# Altium project roneMotorBoard-v8.PrjPcb
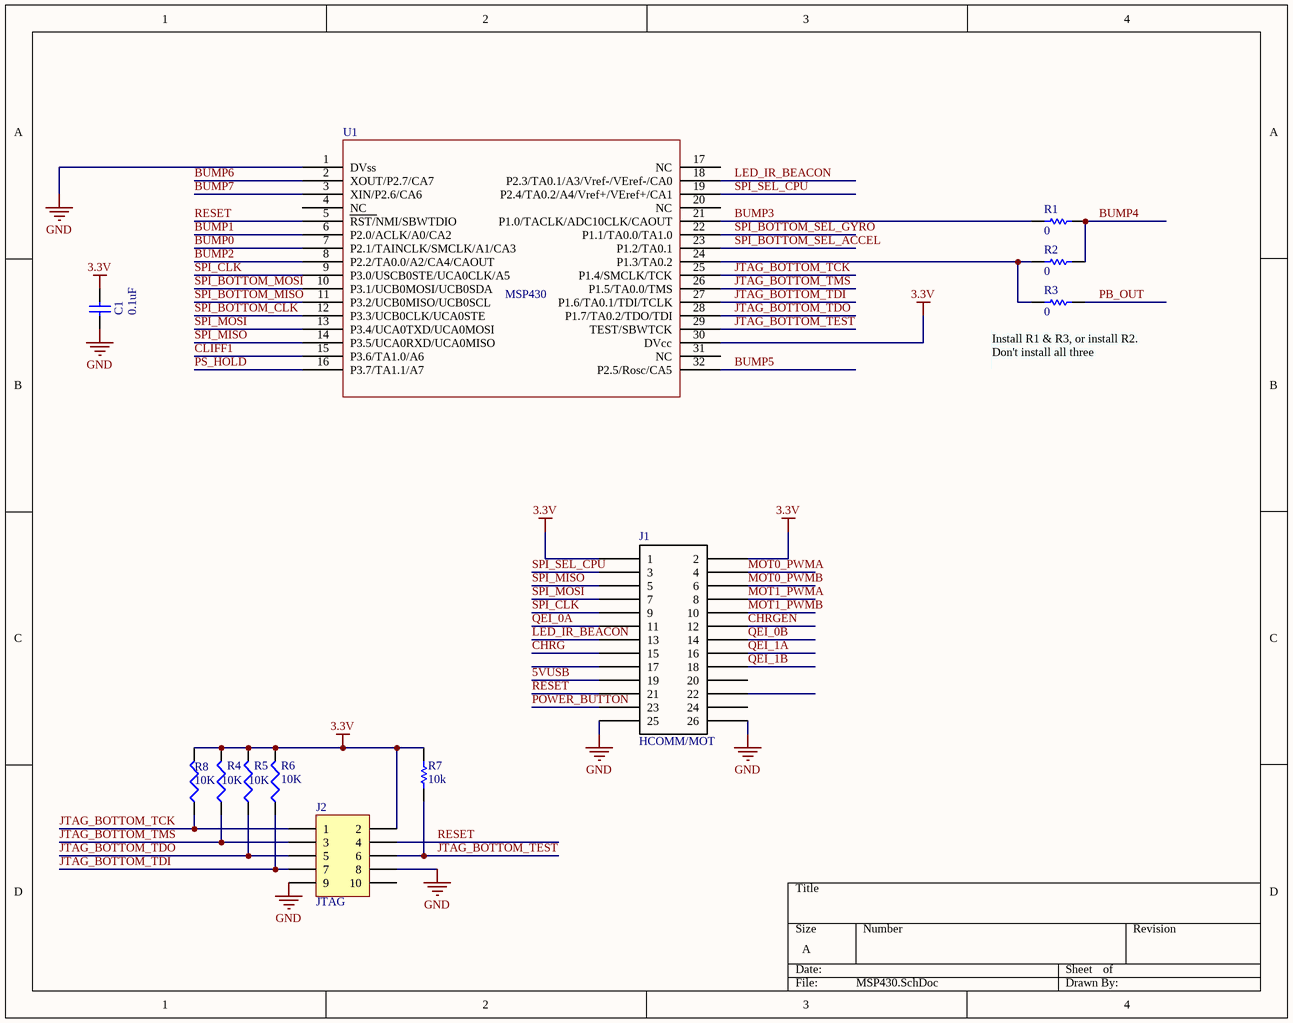
[diagram p0: MSP430.SchDoc]
5 sheets, 94 parts. Net scope: global (net labels, ports and power ports of the same name join across sheets).
Board file: roneMotorBoard-v8.PcbDoc
Sheets:
  MSP430.SchDoc
  power.SchDoc
  motorEncoder.SchDoc
  GyroAccelHeaders.SchDoc
  BumpSensors.SchDoc

## Sheet MSP430.SchDoc
size A

### Parts
C1  value 0.1uF  [CAPC1005L]  (hidden comment: Cap Semi)
J1  HCOMM/MOT  [HeaderSM 13x2]
J2  JTAG  [HDR2X5]
R1  value 0  [RESC1608L]  (hidden comment: Res Semi)
R2  value 0  [RESC1608L]  (hidden comment: Res Semi)
R3  value 0  [RESC1608L]  (hidden comment: Res Semi)
R4  value 10K  [RESC1608L]  (hidden comment: Res3)
R5  value 10K  [RESC1608L]  (hidden comment: Res3)
R6  value 10K  [RESC1608L]  (hidden comment: Res3)
R7  value 10k  [RESC1608L]  (hidden comment: Res Semi)
R8  value 10K  [RESC1608L]  (hidden comment: Res3)
U1  MSP430  [MSP430_32PIN]

### Nets
3.3V: C1.2 J1.1 J1.2 J2.2 R4.2 R5.2 R6.2 R7.2 R8.2 U1.30(DVcc)
GND: C1.1 J1.25 J1.26 J2.8 J2.9 U1.1(DVss)
5VUSB: J1.19
BUMP0: U1.7(P2.1/TAINCLK/SMCLK/A1/CA3)
BUMP1: U1.6(P2.0/ACLK/A0/CA2)
BUMP2: U1.8(P2.2/TA0.0/A2/CA4/CAOUT)
BUMP3: R1.2 U1.21(P1.0/TACLK/ADC10CLK/CAOUT)
BUMP4: R1.1 R2.1
BUMP5: U1.32(P2.5/Rosc/CA5)
BUMP6: U1.2(XOUT/P2.7/CA7)
BUMP7: U1.3(XIN/P2.6/CA6)
CHRG: J1.15
CHRGEN: J1.12
CLIFF1: U1.15(P3.6/TA1.0/A6)
JTAG_BOTTOM_TCK: J2.1 R8.1 U1.25(P1.4/SMCLK/TCK)
JTAG_BOTTOM_TDI: J2.7 R6.1 U1.27(P1.6/TA0.1/TDI/TCLK)
JTAG_BOTTOM_TDO: J2.5 R5.1 U1.28(P1.7/TA0.2/TDO/TDI)
JTAG_BOTTOM_TEST: J2.6 R7.1 U1.29(TEST/SBWTCK)
JTAG_BOTTOM_TMS: J2.3 R4.1 U1.26(P1.5/TA0.0/TMS)
LED_IR_BEACON: J1.13 U1.18(P2.3/TA0.1/A3/Vref-/VEref-/CA0)
MOT0_PWMA: J1.4
MOT0_PWMB: J1.6
MOT1_PWMA: J1.8
MOT1_PWMB: J1.10
PB_OUT: R3.1
POWER_BUTTON: J1.23
PS_HOLD: U1.16(P3.7/TA1.1/A7)
QEI_0A: J1.11
QEI_0B: J1.14
QEI_1A: J1.16
QEI_1B: J1.18
RESET: J1.21 J2.4 U1.5(RST/NMI/SBWTDIO)
SPI_BOTTOM_CLK: U1.12(P3.3/UCB0CLK/UCA0STE)
SPI_BOTTOM_MISO: U1.11(P3.2/UCB0MISO/UCB0SCL)
SPI_BOTTOM_MOSI: U1.10(P3.1/UCB0MOSI/UCB0SDA)
SPI_BOTTOM_SEL_ACCEL: U1.23(P1.2/TA0.1)
SPI_BOTTOM_SEL_GYRO: U1.22(P1.1/TA0.0/TA1.0)
SPI_CLK: J1.9 U1.9(P3.0/USCB0STE/UCA0CLK/A5)
SPI_MISO: J1.5 U1.14(P3.5/UCA0RXD/UCA0MISO)
SPI_MOSI: J1.7 U1.13(P3.4/UCA0TXD/UCA0MOSI)
SPI_SEL_CPU: J1.3 U1.19(P2.4/TA0.2/A4/Vref+/VEref+/CA1)
NetR2_2: R2.2 R3.2 U1.24(P1.3/TA0.2)

Not connected (* = marked no-connect by the designer): J1 17 20 22 24; J2 10; U1 4(NC) 17(NC) 20(NC) 31(NC)

### Notes on the sheet
- (near R3) Install R1 & R3, or install R2.  Don't install all three

### Library data of the parts
C1 = Cap Semi: Capacitor (Semiconductor SIM Model); Published: 8-Jun-2000; LatestRevisionDate: 29-May-2009; LatestRevisionNote: IPC-7351 Footprint Added.; PackageReference: C1206; Publisher: Altium Limited; PackageDescription: Chip Capacitor
J1 = HCOMM/HMOT: Header, 2X20, 50mil, IDC
J2 = Header 5X2: Header, 5-Pin, Dual row; LatestRevisionDate: 17-Jul-2002; LatestRevisionNote: Re-released for DXP Platform.; Publisher: Altium Limited
R1-R3 R7 = Res Semi: Semiconductor Resistor; Published: 8-Jun-2000; LatestRevisionDate: 17-Jul-2002; LatestRevisionNote: Re-released for DXP Platform.; PackageReference: AXIAL-0.5; Publisher: Altium Limited
R4-R6 R8 = Res3: Resistor; Published: 8-Jun-2000; LatestRevisionDate: 29-May-2009; LatestRevisionNote: IPC-7351 Footprint Added.; PackageReference: J1-0603; Publisher: Altium Limited; PackageDescription: Chip Resistor
U1 = MSP430_32pin

## Sheet power.SchDoc
size A
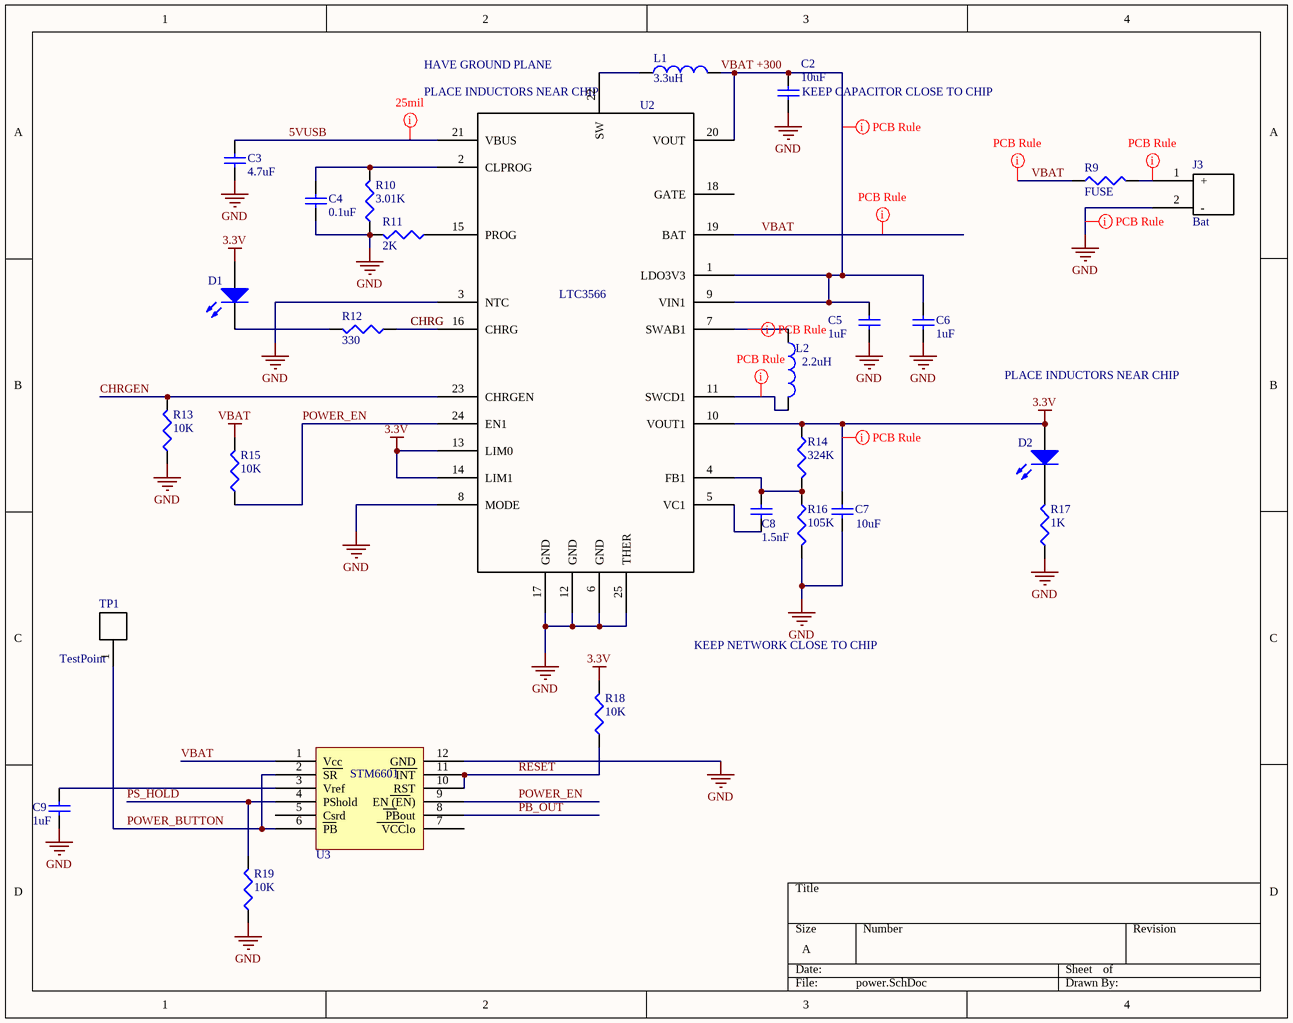
[diagram p1: power.SchDoc]

### Parts
C2  value 10uF  [CAPC1608L]  (hidden comment: Cap)
C3  value 4.7uF  [CAPC1608L]  (hidden comment: Cap)
C4  value 0.1uF  [CAPC1005L]  (hidden comment: Cap)
C5  value 1uF  [CAPC1608L]  (hidden comment: Cap)
C6  value 1uF  [CAPC1608L]  (hidden comment: Cap)
C7  value 10uF  [CAPC1608L]  (hidden comment: Cap)
C8  value 1.5nF  [CAPC1005L]  (hidden comment: Cap)
C9  value 1uF  [CAPC1608L]  (hidden comment: Cap)
D1  Charge  [INDC2012L]  (value not drawn)
D2  Power  [INDC2012L]  (value not drawn)
J3  Bat  [BatteryConnJST]
L1  3.3uH  [IndPow]
L2  2.2uH  [IndPow]
R9  value FUSE  [RESC3225L]  (hidden comment: Res3)
R10  value 3.01K  [RESC1608L]  (hidden comment: Res3)
R11  value 2K  [RESC1608L]  (hidden comment: Res3)
R12  value 330  [RESC1608L]  (hidden comment: Res3)
R13  value 10K  [RESC1608L]  (hidden comment: Res3)
R14  value 324K  [RESC1608L]  (hidden comment: Res3)
R15  value 10K  [RESC1608L]  (hidden comment: Res3)
R16  value 105K  [RESC1608L]  (hidden comment: Res3)
R17  value 1K  [RESC1608L]  (hidden comment: Res3)
R18  value 10K  [RESC1608L]  (hidden comment: Res3)
R19  value 10K  [RESC1608L]  (hidden comment: Res3)
TP1  TestPoint  [TestPoint]
U2  LTC3566  [QFN-24]
U3  STM6601  [TDFN12]

### Nets
3.3V: C7.2 D1.1(A) D2.1(A) R14.1 R18.2 U2.10(VOUT1) U2.13(LIM0) U2.14(LIM1)
GND: C2.1 C3.1 C4.1 C5.2 C6.2 C7.1 C9.2 J3.2(-) R10.1 R11.2 R13.1 R16.2 R17.1 R19.1 U2.3(NTC) U2.6(GND) U2.8(MODE) U2.12(GND) U2.17(GND) U2.25(THER) U3.12(GND)
VBAT: R9.1 R15.2 U2.19(BAT) U3.1(Vcc)
5VUSB: C3.2 U2.21(VBUS)
CHRG: R12.1 U2.16(CHRG)
CHRGEN: R13.2 U2.23(CHRGEN)
PB_OUT: U3.8(PBout)
POWER_BUTTON: TP1.1 U3.2(SR) U3.6(PB)
POWER_EN: R15.1 U2.24(EN1) U3.9(EN_(EN))
PS_HOLD: R19.2 U3.4(PShold)
RESET: R18.1 U3.10(RST) U3.11(INT)
VBAT +300: C2.2 C5.1 C6.1 L1.2 U2.1(LDO3V3) U2.9(VIN1) U2.20(VOUT)
NetC4_2: C4.2 R10.2 U2.2(CLPROG)
NetC8_1: C8.1 R14.2 R16.1 U2.4(FB1)
NetC8_2: C8.2 U2.5(VC1)
NetC9_1: C9.1 U3.3(Vref)
NetD1_2: D1.2(K) R12.2
NetD2_2: D2.2(K) R17.2
NetJ3_1: J3.1(+) R9.2
NetL1_1: L1.1 U2.22(SW)
NetL2_1: L2.1 U2.7(SWAB1)
NetL2_2: L2.2 U2.11(SWCD1)
NetR11_1: R11.1 U2.15(PROG)

Not connected (* = marked no-connect by the designer): U2 18(GATE); U3 5(Csrd) 7(VCClo)

### Layout directives
rule Width Constraint [Pref Width = 25mil    Min Width = 10mil    Max Width = 25mil]: 5VUSB, GND, NetJ3_1, NetL2_1, NetL2_2, VBAT, VBAT +300
rule Width Constraint [Pref Width = 25mil    Min Width = 10mil    Max Width = 100mil]: 3.3V
rule Width Constraint [Pref Width = 25mil    Min Width = 10mil    Max Width = 50mil]: VBAT

### Notes on the sheet
- (near U2) HAVE GROUND PLANE
- (near U2) PLACE INDUCTORS NEAR CHIP
- (near C2) KEEP CAPACITOR CLOSE TO CHIP
- CHRG
- PLACE INDUCTORS NEAR CHIP
- KEEP NETWORK CLOSE TO CHIP

### Library data of the parts
C2-C9 = Cap: Capacitor; Published: 8-Jun-2000; LatestRevisionDate: 17-Jul-2002; LatestRevisionNote: Re-released for DXP Platform.; PackageReference: RAD-0.3; Publisher: Altium Limited
D1 D2 = LED2: Typical RED, GREEN, YELLOW, AMBER GaAs LED; Published: 8-Jun-2000; LatestRevisionDate: 17-Jul-2002; LatestRevisionNote: Re-released for DXP Platform.; PackageVersion: Feb-2002; PackageReference: 3.2X1.6X1.1; Publisher: Altium Limited
J3 = BatteryConnJST
L1 L2 = Inductor
  L1: Value: 3.3uH
  L2: Value: 2.2uH
R9-R19 = Res3: Resistor; Published: 8-Jun-2000; LatestRevisionDate: 29-May-2009; LatestRevisionNote: IPC-7351 Footprint Added.; PackageReference: J1-0603; Publisher: Altium Limited; PackageDescription: Chip Resistor

## Sheet motorEncoder.SchDoc
size A
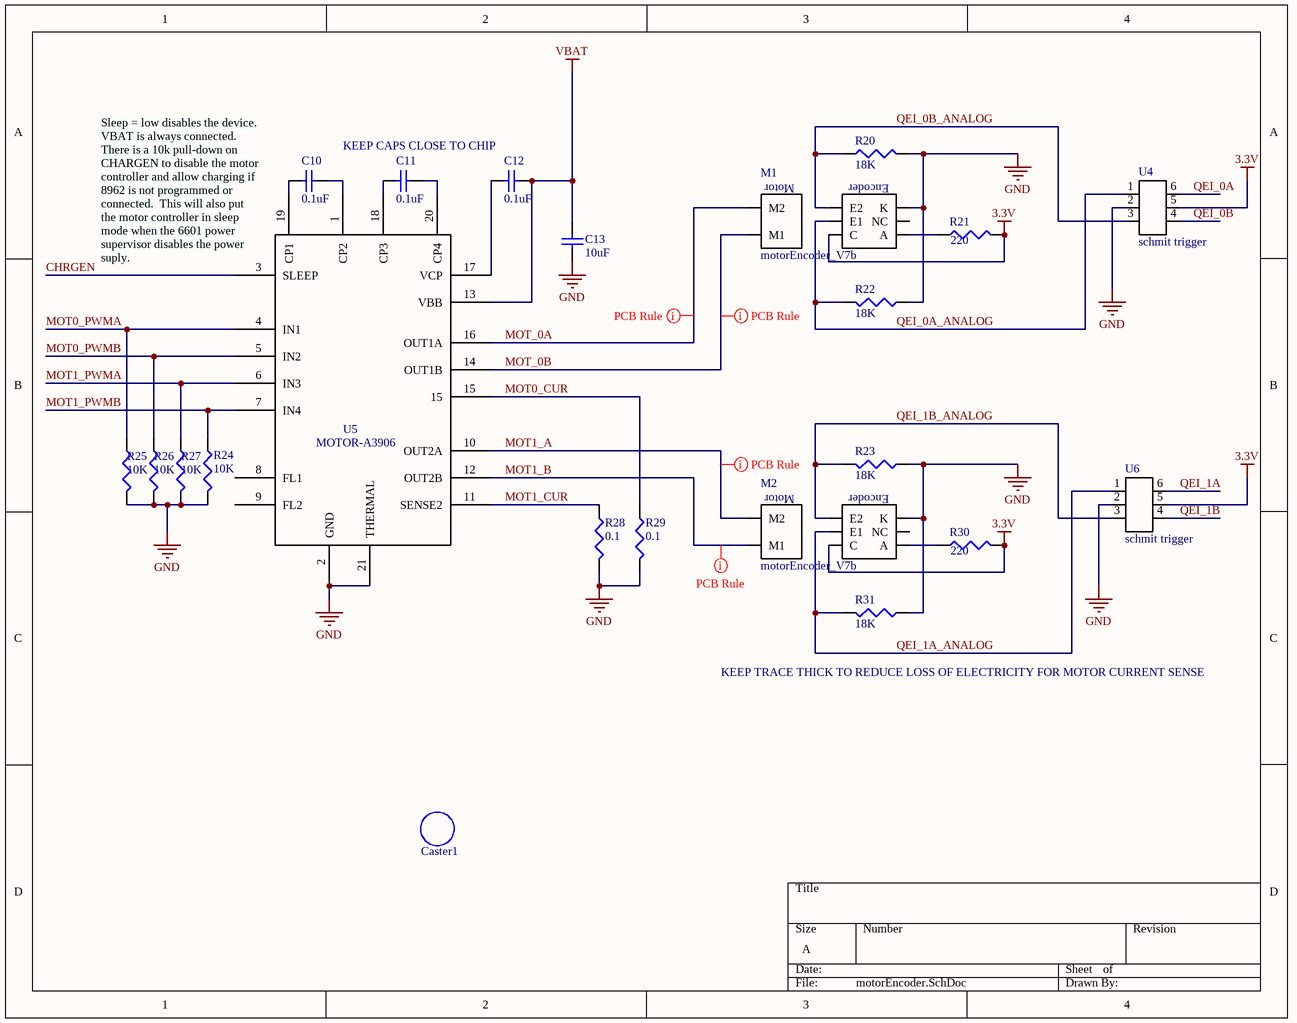
[diagram p2: motorEncoder.SchDoc]

### Parts
C10  value 0.1uF  [CAPC1005L]  (hidden comment: Cap Semi)
C11  value 0.1uF  [CAPC1005L]  (hidden comment: Cap Semi)
C12  value 0.1uF  [CAPC1005L]  (hidden comment: Cap Semi)
C13  value 10uF  [CAPC1608L]  (hidden comment: Cap Semi)
Caster1  non connect  [3/4"CASTER2]  (value not drawn)
M1  motorEncoder_V7b  [motorEncoder_V7b]
M2  motorEncoder_V7b  [motorEncoder_V7b]
R20  value 18K  [RESC1608L]
R21  value 220  [RESC1608L]
R22  value 18K  [RESC1608L]
R23  value 18K  [RESC1608L]
R24  value 10K  [RESC1608L]  (hidden comment: Res3)
R25  value 10K  [RESC1608L]  (hidden comment: Res3)
R26  value 10K  [RESC1608L]  (hidden comment: Res3)
R27  value 10K  [RESC1608L]  (hidden comment: Res3)
R28  value 0.1  [RESC1608L]  (hidden comment: Res3)
R29  value 0.1  [RESC1608L]  (hidden comment: Res3)
R30  value 220  [RESC1608L]
R31  value 18K  [RESC1608L]
U4  schmit trigger  [DCK(R-PDSO-C6)]
U5  MOTOR-A3906  [QFN-20]
U6  schmit trigger  [DCK(R-PDSO-C6)]

### Nets
3.3V: M1.C M2.C R21.2 R30.2 U4.5 U6.5
GND: C13.1 M1.K M2.K R20.2 R22.1 R23.1 R24.2 R25.2 R26.2 R27.2 R28.2 R29.2 R31.1 U4.2 U5.2(GND) U5.21(THERMAL) U6.2
VBAT: C12.1 C13.2 U5.13(VBB)
CHRGEN: U5.3(SLEEP)
MOT0_CUR: R29.1 U5.15
MOT0_PWMA: R25.1 U5.4(IN1)
MOT0_PWMB: R26.1 U5.5(IN2)
MOT1_A: M2.M2 U5.10(OUT2A)
MOT1_B: M2.M1 U5.12(OUT2B)
MOT1_CUR: R28.1 U5.11(SENSE2)
MOT1_PWMA: R27.1 U5.6(IN3)
MOT1_PWMB: R24.1 U5.7(IN4)
MOT_0A: M1.M2 U5.16(OUT1A)
MOT_0B: M1.M1 U5.14(OUT1B)
QEI_0A: U4.6
QEI_0A_ANALOG: M1.E1 R22.2 U4.1
QEI_0B: U4.4
QEI_0B_ANALOG: M1.E2 R20.1 U4.3
QEI_1A: U6.6
QEI_1A_ANALOG: M2.E1 R31.2 U6.1
QEI_1B: U6.4
QEI_1B_ANALOG: M2.E2 R23.2 U6.3
NetC10_1: C10.1 U5.19(CP1)
NetC10_2: C10.2 U5.1(CP2)
NetC11_1: C11.1 U5.18(CP3)
NetC11_2: C11.2 U5.20(CP4)
NetC12_2: C12.2 U5.17(VCP)
NetM1_A: M1.A R21.1
NetM2_A: M2.A R30.1

Not connected (* = marked no-connect by the designer): M1 NC; M2 NC; U5 8(FL1) 9(FL2)

### Layout directives
rule Width Constraint [Pref Width = 20mil    Min Width = 10mil    Max Width = 25mil]: MOT1_A, MOT1_B, MOT_0A, MOT_0B

### Notes on the sheet
- KEEP CAPS CLOSE TO CHIP
- (near U5) Sleep = low disables the device.  VBAT is always connected. There is a 10k pull-down on CHARGEN to disable the motor controller and allow charging if 8962 is not programmed or connected.  This will also put the motor controller in sleep mode when the 6601 power supervisor disables the power suply.
- KEEP TRACE THICK TO REDUCE LOSS OF ELECTRICITY FOR MOTOR CURRENT SENSE
- (in symbol motorEncoder_V7b) Motor; Encoder

### Library data of the parts
C10-C13 = Cap Semi: Capacitor (Semiconductor SIM Model); Published: 8-Jun-2000; LatestRevisionDate: 29-May-2009; LatestRevisionNote: IPC-7351 Footprint Added.; PackageReference: C1206; Publisher: Altium Limited; PackageDescription: Chip Capacitor
Caster1 = Caster 3/4in: This is just a space saver to get the caster onto the pcb
R20-R31 = Res3: Resistor; Published: 8-Jun-2000; LatestRevisionDate: 29-May-2009; LatestRevisionNote: IPC-7351 Footprint Added.; PackageReference: J1-0603; Publisher: Altium Limited; PackageDescription: Chip Resistor

## Sheet GyroAccelHeaders.SchDoc
size A
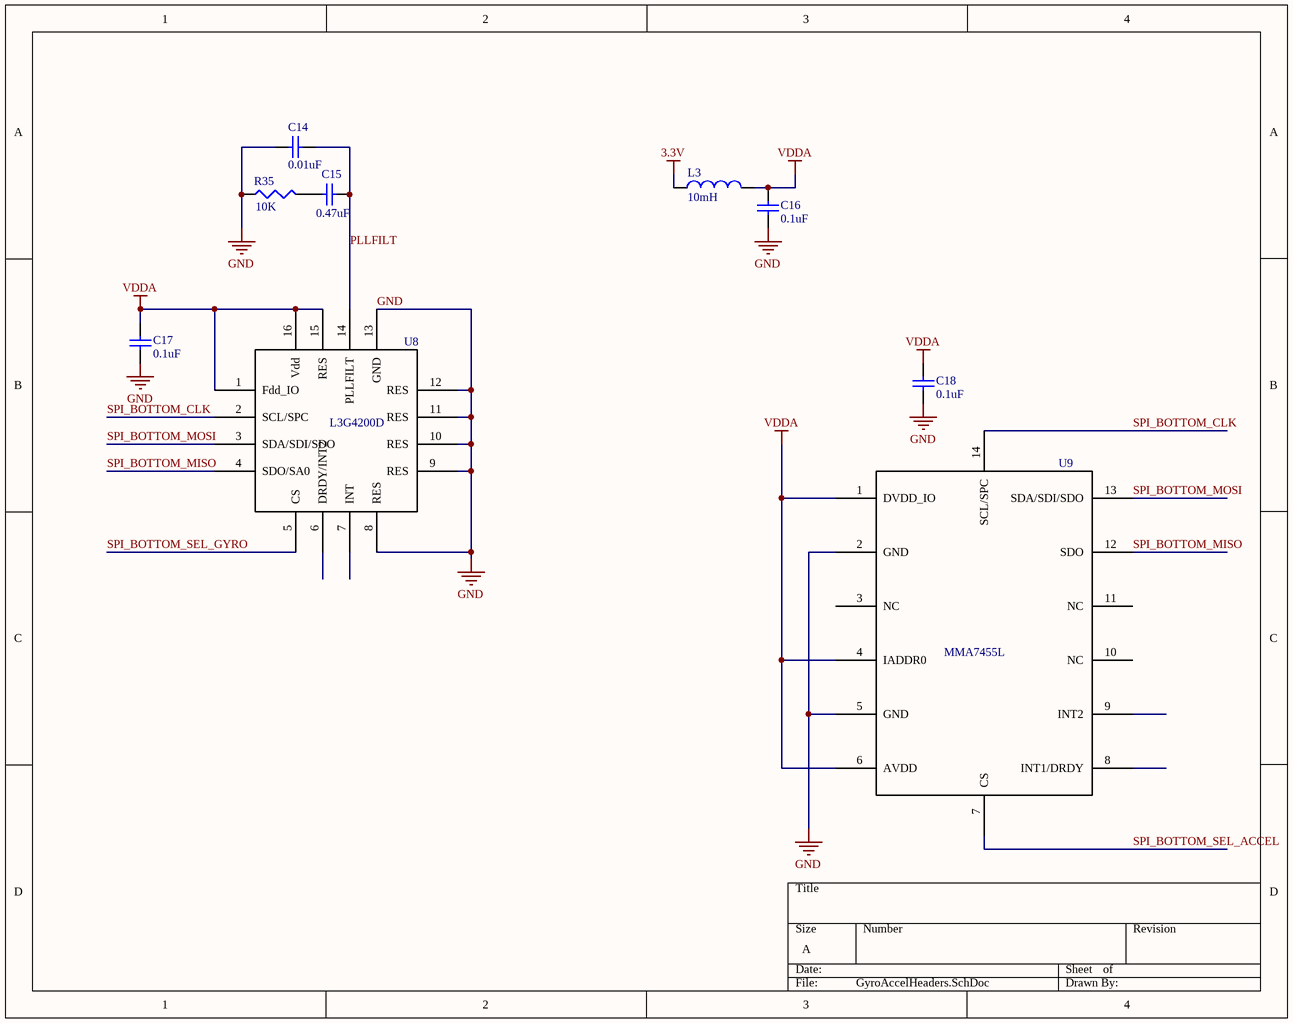
[diagram p3: GyroAccelHeaders.SchDoc]

### Parts
C14  value 0.01uF  [CAPC1005L]  (hidden comment: Cap Semi)
C15  value 0.47uF  [CAPC1005L]  (hidden comment: Cap Semi)
C16  value 0.1uF  [CAPC1005L]  (hidden comment: Cap Semi)
C17  value 0.1uF  [CAPC1005L]  (hidden comment: Cap Semi)
C18  value 0.1uF  [CAPC1005L]  (hidden comment: Cap Semi)
L3  value 10mH  [INDC2012L]  (hidden comment: Inductor)
R35  value 10K  [RESC1608L]  (hidden comment: Res3)
U8  L3G4200D  [L3G2004D]
U9  MMA7455L  [MMA7455L]

### Nets
3.3V: L3.2
GND: C14.2 C16.1 C17.1 C18.1 R35.1 U8.8(RES) U8.9(RES) U8.10(RES) U8.11(RES) U8.12(RES) U8.13(GND) U9.2(GND) U9.5(GND)
VDDA: C16.2 C17.2 C18.2 L3.1 U8.1(Fdd_IO) U8.15(RES) U8.16(Vdd) U9.1(DVDD_IO) U9.4(IADDR0) U9.6(AVDD)
PLLFILT: C14.1 C15.1 U8.14(PLLFILT)
SPI_BOTTOM_CLK: U8.2(SCL/SPC) U9.14(SCL/SPC)
SPI_BOTTOM_MISO: U8.4(SDO/SA0) U9.12(SDO)
SPI_BOTTOM_MOSI: U8.3(SDA/SDI/SDO) U9.13(SDA/SDI/SDO)
SPI_BOTTOM_SEL_ACCEL: U9.7(CS)
SPI_BOTTOM_SEL_GYRO: U8.5(CS)
NetC15_2: C15.2 R35.2

Not connected (* = marked no-connect by the designer): U8 6(DRDY/INT2) 7(INT); U9 3(NC) 8(INT1/DRDY) 9(INT2) 10(NC) 11(NC)

### Library data of the parts
C14-C18 = Cap Semi: Capacitor (Semiconductor SIM Model); Published: 8-Jun-2000; LatestRevisionDate: 29-May-2009; LatestRevisionNote: IPC-7351 Footprint Added.; PackageReference: C1206; Publisher: Altium Limited; PackageDescription: Chip Capacitor
L3 = Inductor: Code_IEC: 1005; Published: 8-Jun-2000; LatestRevisionDate: 29-May-2009; LatestRevisionNote: IPC-7351 Footprint Added.; PackageReference: 0402-A; Publisher: Altium Limited; PackageDescription: Chip Inductor; Code_JEITA: 0402
R35 = Res3: Resistor; Published: 8-Jun-2000; LatestRevisionDate: 29-May-2009; LatestRevisionNote: IPC-7351 Footprint Added.; PackageReference: J1-0603; Publisher: Altium Limited; PackageDescription: Chip Resistor
U8 = L3G4200D: 3axis gyroscope, SPI
U9 = MMA7455L: 3axis accelerometer

## Sheet BumpSensors.SchDoc
size A
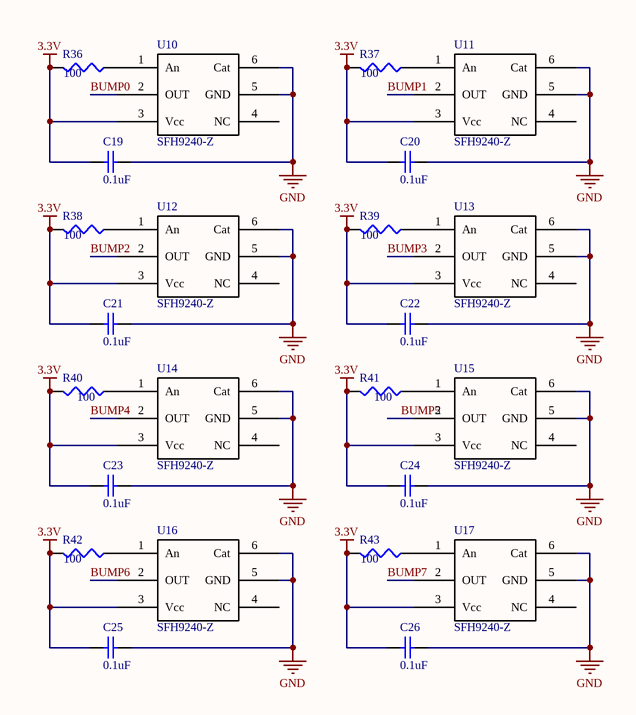
[diagram p4: BumpSensors.SchDoc]

### Parts
C19  value 0.1uF  [CAPC1005L]  (hidden comment: Cap Semi)
C20  value 0.1uF  [CAPC1005L]  (hidden comment: Cap Semi)
C21  value 0.1uF  [CAPC1005L]  (hidden comment: Cap Semi)
C22  value 0.1uF  [CAPC1005L]  (hidden comment: Cap Semi)
C23  value 0.1uF  [CAPC1005L]  (hidden comment: Cap Semi)
C24  value 0.1uF  [CAPC1005L]  (hidden comment: Cap Semi)
C25  value 0.1uF  [CAPC1005L]  (hidden comment: Cap Semi)
C26  value 0.1uF  [CAPC1005L]  (hidden comment: Cap Semi)
R36  value 100  [RESC1608L]  (hidden comment: Res3)
R37  value 100  [RESC1608L]  (hidden comment: Res3)
R38  value 100  [RESC1608L]  (hidden comment: Res3)
R39  value 100  [RESC1608L]  (hidden comment: Res3)
R40  value 100  [RESC1608L]  (hidden comment: Res3)
R41  value 100  [RESC1608L]  (hidden comment: Res3)
R42  value 100  [RESC1608L]  (hidden comment: Res3)
R43  value 100  [RESC1608L]  (hidden comment: Res3)
U10  SFH9240-Z  [SFH9240-Z]
U11  SFH9240-Z  [SFH9240-Z]
U12  SFH9240-Z  [SFH9240-Z]
U13  SFH9240-Z  [SFH9240-Z]
U14  SFH9240-Z  [SFH9240-Z]
U15  SFH9240-Z  [SFH9240-Z]
U16  SFH9240-Z  [SFH9240-Z]
U17  SFH9240-Z  [SFH9240-Z]

### Nets
3.3V: C19.2 C20.2 C21.2 C22.2 C23.2 C24.2 C25.2 C26.2 R36.2 R37.2 R38.2 R39.2 R40.2 R41.2 R42.2 R43.2 U10.3(Vcc) U11.3(Vcc) U12.3(Vcc) U13.3(Vcc) U14.3(Vcc) U15.3(Vcc) U16.3(Vcc) U17.3(Vcc)
GND: C19.1 C20.1 C21.1 C22.1 C23.1 C24.1 C25.1 C26.1 U10.5(GND) U10.6(Cat) U11.5(GND) U11.6(Cat) U12.5(GND) U12.6(Cat) U13.5(GND) U13.6(Cat) U14.5(GND) U14.6(Cat) U15.5(GND) U15.6(Cat) U16.5(GND) U16.6(Cat) U17.5(GND) U17.6(Cat)
BUMP0: U10.2(OUT)
BUMP1: U11.2(OUT)
BUMP2: U12.2(OUT)
BUMP3: U13.2(OUT)
BUMP4: U14.2(OUT)
BUMP5: U15.2(OUT)
BUMP6: U16.2(OUT)
BUMP7: U17.2(OUT)
NetR36_1: R36.1 U10.1(An)
NetR37_1: R37.1 U11.1(An)
NetR38_1: R38.1 U12.1(An)
NetR39_1: R39.1 U13.1(An)
NetR40_1: R40.1 U14.1(An)
NetR41_1: R41.1 U15.1(An)
NetR42_1: R42.1 U16.1(An)
NetR43_1: R43.1 U17.1(An)

Not connected (* = marked no-connect by the designer): U10 4(NC); U11 4(NC); U12 4(NC); U13 4(NC); U14 4(NC); U15 4(NC); U16 4(NC); U17 4(NC)

### Library data of the parts
C19-C26 = Cap Semi: Capacitor (Semiconductor SIM Model); Published: 8-Jun-2000; LatestRevisionDate: 29-May-2009; LatestRevisionNote: IPC-7351 Footprint Added.; PackageReference: C1206; Publisher: Altium Limited; PackageDescription: Chip Capacitor
R36-R43 = Res3: Resistor; Published: 8-Jun-2000; LatestRevisionDate: 29-May-2009; LatestRevisionNote: IPC-7351 Footprint Added.; PackageReference: J1-0603; Publisher: Altium Limited; PackageDescription: Chip Resistor

## Nets that join several sheets
3.3V: MSP430 (10 pins), power (8 pins), motorEncoder (6 pins), GyroAccelHeaders (L3.2), BumpSensors (24 pins)
GND: MSP430 (6 pins), power (21 pins), motorEncoder (17 pins), GyroAccelHeaders (13 pins), BumpSensors (24 pins)
VBAT: power (R9.1 R15.2 U2.19 U3.1), motorEncoder (C12.1 C13.2 U5.13)
5VUSB: MSP430 (J1.19), power (C3.2 U2.21)
BUMP0: MSP430 (U1.7), BumpSensors (U10.2)
BUMP1: MSP430 (U1.6), BumpSensors (U11.2)
BUMP2: MSP430 (U1.8), BumpSensors (U12.2)
BUMP3: MSP430 (R1.2 U1.21), BumpSensors (U13.2)
BUMP4: MSP430 (R1.1 R2.1), BumpSensors (U14.2)
BUMP5: MSP430 (U1.32), BumpSensors (U15.2)
BUMP6: MSP430 (U1.2), BumpSensors (U16.2)
BUMP7: MSP430 (U1.3), BumpSensors (U17.2)
CHRG: MSP430 (J1.15), power (R12.1 U2.16)
CHRGEN: MSP430 (J1.12), power (R13.2 U2.23), motorEncoder (U5.3)
MOT0_PWMA: MSP430 (J1.4), motorEncoder (R25.1 U5.4)
MOT0_PWMB: MSP430 (J1.6), motorEncoder (R26.1 U5.5)
MOT1_PWMA: MSP430 (J1.8), motorEncoder (R27.1 U5.6)
MOT1_PWMB: MSP430 (J1.10), motorEncoder (R24.1 U5.7)
PB_OUT: MSP430 (R3.1), power (U3.8)
POWER_BUTTON: MSP430 (J1.23), power (TP1.1 U3.2 U3.6)
PS_HOLD: MSP430 (U1.16), power (R19.2 U3.4)
QEI_0A: MSP430 (J1.11), motorEncoder (U4.6)
QEI_0B: MSP430 (J1.14), motorEncoder (U4.4)
QEI_1A: MSP430 (J1.16), motorEncoder (U6.6)
QEI_1B: MSP430 (J1.18), motorEncoder (U6.4)
RESET: MSP430 (J1.21 J2.4 U1.5), power (R18.1 U3.10 U3.11)
SPI_BOTTOM_CLK: MSP430 (U1.12), GyroAccelHeaders (U8.2 U9.14)
SPI_BOTTOM_MISO: MSP430 (U1.11), GyroAccelHeaders (U8.4 U9.12)
SPI_BOTTOM_MOSI: MSP430 (U1.10), GyroAccelHeaders (U8.3 U9.13)
SPI_BOTTOM_SEL_ACCEL: MSP430 (U1.23), GyroAccelHeaders (U9.7)
SPI_BOTTOM_SEL_GYRO: MSP430 (U1.22), GyroAccelHeaders (U8.5)